# Altium project PCB 4-20MA.PrjPCB
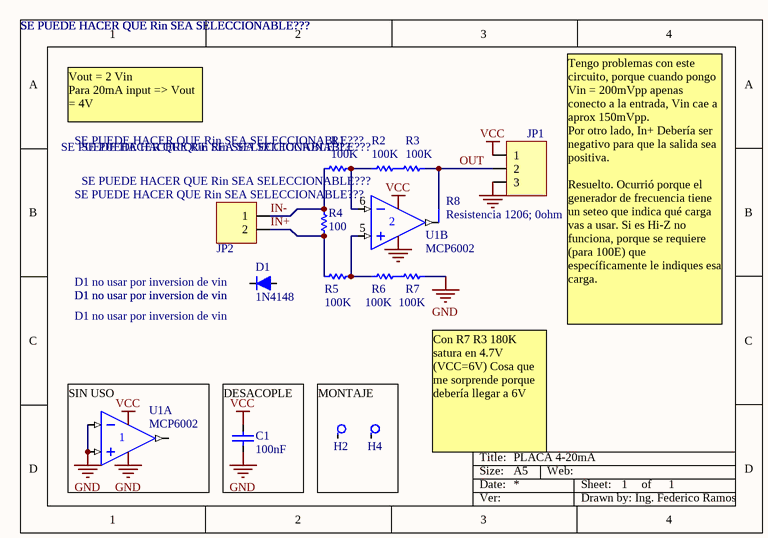
[diagram p0: PCB 4-20MA.SchDoc]
1 sheet, 15 parts. Net scope: global (net labels, ports and power ports of the same name join across sheets).
Board file: PCB 4-20MA.PcbDoc

## Sheet PCB 4-20MA.SchDoc: PLACA 4-20mA
size 139 x 96 mm; SheetNumber: 1; SheetTotal: 1; PageSetup: Record=PageOptions|CenterHorizontal=True|CenterVertical=True|PrintScale=1.97|XCorrection=1.00|YCorrection=1.00|PrintKind=0|BorderSize=5000000|LeftOffset=0|BottomOffset=0|Orientation=2|PaperLength=1000|PaperWidth=1000|Scale=100|PaperSource=7|PrintQuality=-4|MediaType=1|DitherType=10|PaperKind=Letter|PrintScaleMode=1

### Parts
C1  Capacidad: 100nF  [C1206]  (hidden comment: Capacitor 1206; 100nF; 50V)
D1  1N4148  [SOD123]
H2  Agujero de Montaje  [agujero]  (value not drawn)  (no BOM)
H4  Agujero de Montaje  [agujero]  (value not drawn)  (no BOM)
JP1  Header3x1  [conpol3x1]  (value not drawn)
JP2  Header2x1  [CONPOL2X1]  (value not drawn)
R1  Resistencia: 100K  [RES300th]  (hidden comment: Resistencia 1Kohm 5W)
R2  Resistencia: 100K  [RES300th]  (hidden comment: Resistencia 1Kohm 5W)
R3  Resistencia: 100K  [RES300th]  (hidden comment: Resistencia 1Kohm 5W)
R4  Resistencia: 100  [RES300th]  (hidden comment: Resistencia 1Kohm 5W)
R5  Resistencia: 100K  [RES300th]  (hidden comment: Resistencia 1Kohm 5W)
R6  Resistencia: 100K  [RES300th]  (hidden comment: Resistencia 1Kohm 5W)
R7  Resistencia: 100K  [RES300th]  (hidden comment: Resistencia 1Kohm 5W)
R8  Resistencia 1206; 0ohm  [R1206]
U1  MCP6002  [dip8z]  (parts A,B of 2)

### Nets
GND: C1.1 JP1.3 R7.1 U1.2(IN-) U1.3(IN+) U1.4(V-)
VCC: C1.2 JP1.1 U1.8(V+)
IN+: JP2.2 R4.1 R5.2
IN-: JP2.1 R1.2 R4.2
OUT: JP1.2 R3.1 R8.2
NetR1_1: R1.1 R2.2 U1.6(IN-)
NetR2_1: R2.1 R3.2
NetR5_1: R5.1 R6.2 U1.5(IN+)
NetR6_1: R6.1 R7.2
NetR8_1: R8.1 U1.7(OUT)

Not connected (* = marked no-connect by the designer): D1 1 2; H2 1; H4 1; U1 1(OUT)

### Notes on the sheet
- SE PUEDE HACER QUE Rin SEA SELECCIONABLE???
- (near R1) SE PUEDE HACER QUE Rin SEA SELECCIONABLE???
- Vout = 2 Vin
  Para 20mA input => Vout = 4V
- (near D1) D1 no usar por inversion de vin
- Tengo problemas con este circuito, porque cuando pongo Vin = 200mVpp apenas conecto a la entrada, Vin cae a aprox 150mVpp.
  Por otro lado, In+ Debería ser negativo para que la salida sea positiva.
  Resuelto. Ocurrió porque el generador de frecuencia tiene un seteo que indica qué carga vas a usar. Si es Hi-Z no funciona, porque se requiere (para 100E) que específicamente le indiques esa carga.
- (near U1) SIN USO
- (near C1) DESACOPLE
- MONTAJE
- Con R7 R3 180K satura en 4.7V (VCC=6V) Cosa que me sorprende porque debería llegar a 6V
- Title:
- Size:
- Date:
- A5
- Web:
- Sheet:
- of
- Ver:
- Drawn by: Ing. Federico Ramos

### Library data of the parts
C1 = Capacitor 1206; 100nF; 50V: Dolares Elemon: 0.03125; Codigo Elemon: CA3269770K; Voltaje: 50V
D1 = 1N4148 SOD123: Dolares Elemon: 0.05230; Codigo Elemon: DI1202050
JP1 = Header3x1: Header 3x1; Price: ?
JP2 = Header2x1: Header 2x1; Price: ?
R1-R7 = Resistencia 1Kohm 5W: Codigo Elemon: RS3886185; Dolares Elemon: 0.00720
R8 = Resistencia 1206; 0ohm: Codigo Elemon: RS3885900; Dolares Elemon: 0.00720
U1 = MCP6002: 1 MHz Bandwidth Low Power Op Amp